# EAGLE design DualDCMotor (EAGLE 6.5.0)
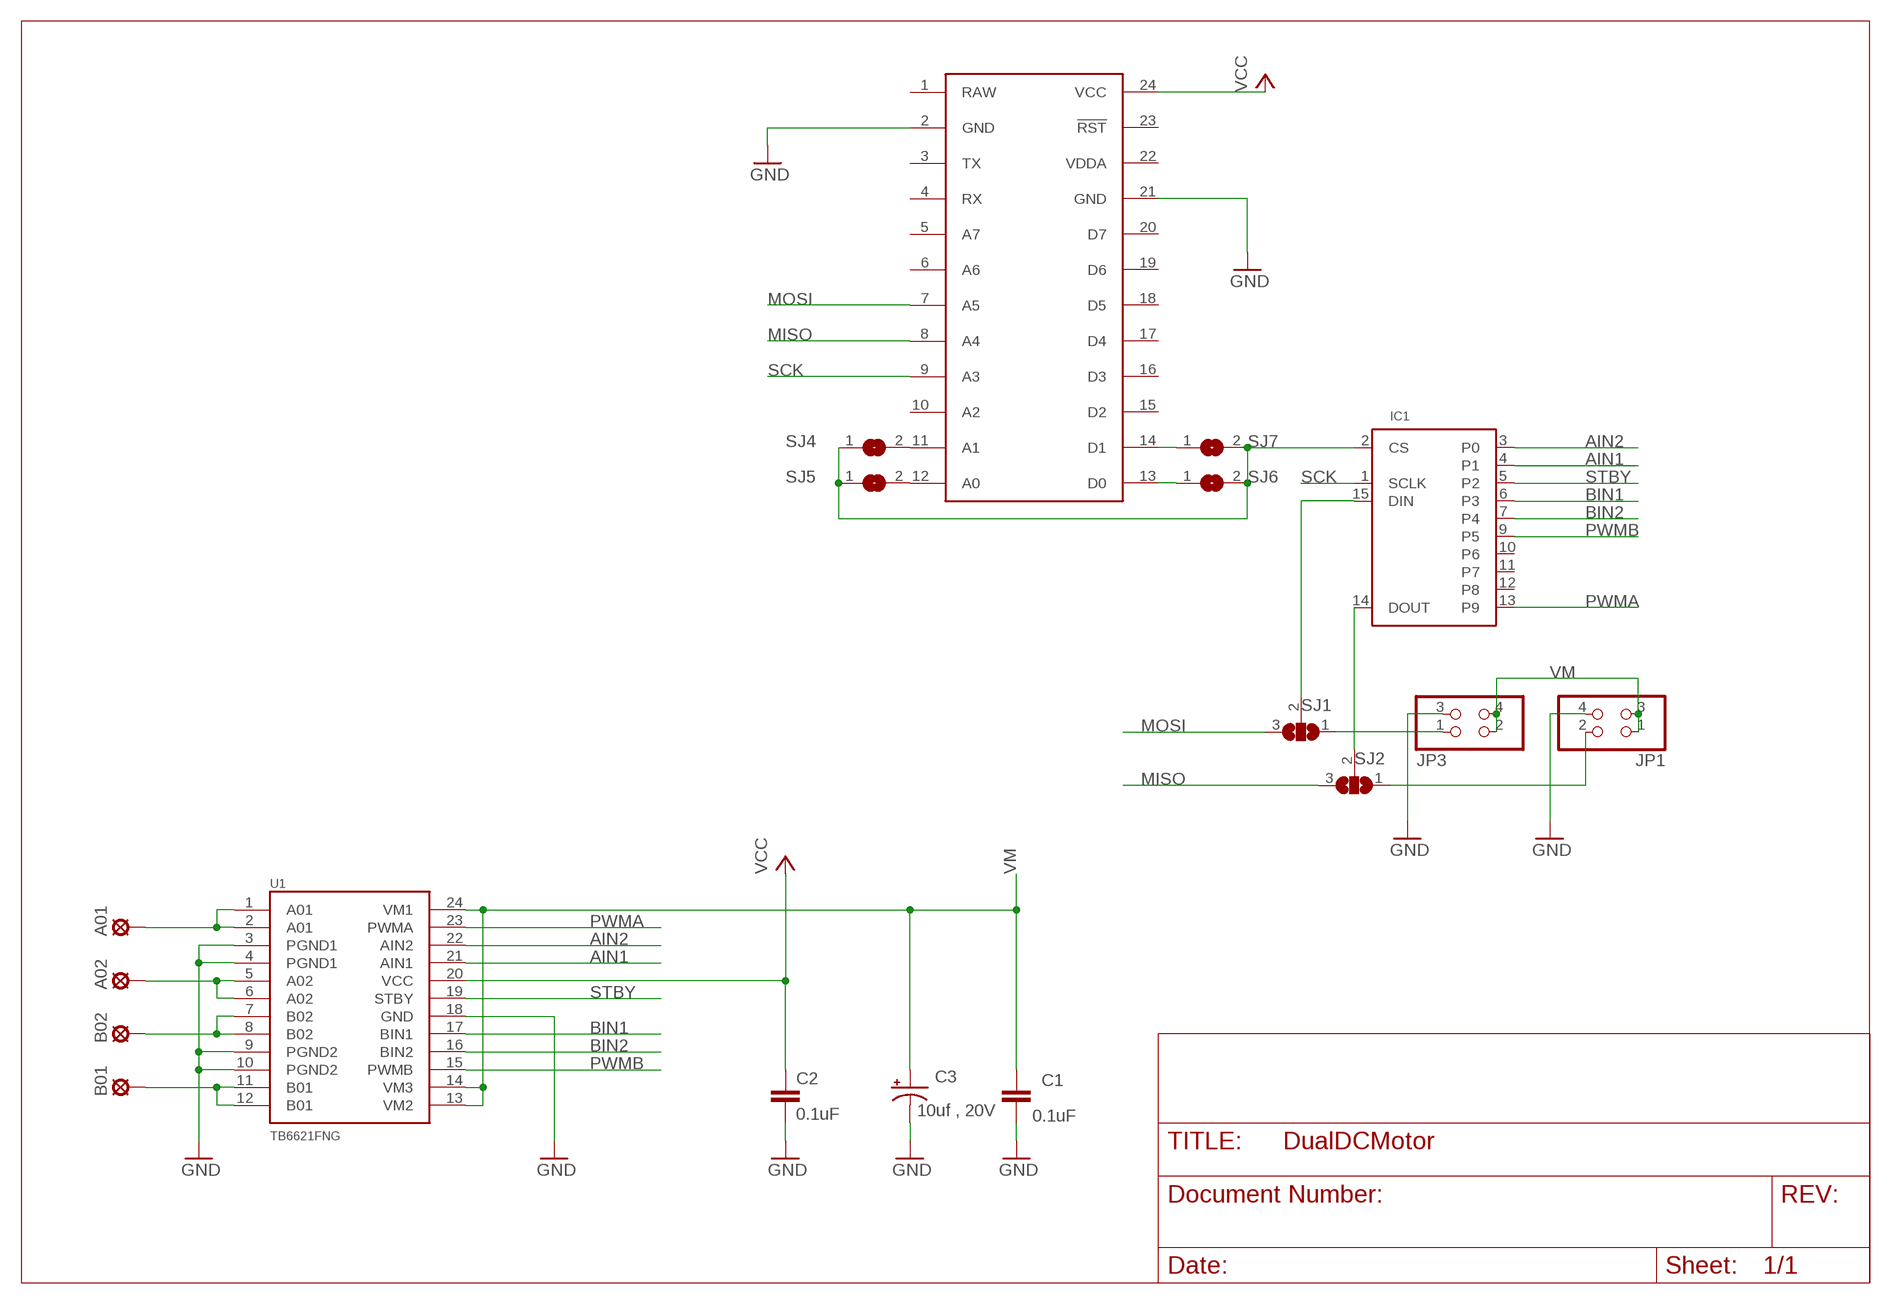
[diagram p0: schematic, sheet 1]

## Parts
A01  LSP13  [LSP13]
A02  LSP13  [LSP13]
B01  LSP13  [LSP13]
B02  LSP13  [LSP13]
C1  0.1uF  CAP0402-CAP  [0402-CAP]
C2  0.1uF  CAP0402-CAP  [0402-CAP]
C3  10uf , 20V  CAP_POL3528  [EIA3528]
IC1  MAX6966AEE  [QSOP16]
JP1  PINHD-2X02_2.54-SMD  [2X02SMD]
JP3  PINHD-2X02_2.54-SMD  [2X02SMD]
SJ1  SJ2W  [SJ_2]
SJ2  SJ2W  [SJ_2]
SJ4  SJ  [SJ]
SJ5  SJ  [SJ]
SJ6  SJ  [SJ]
SJ7  SJ  [SJ]
U1  TB6621FNG  [SSOP24]
U$1  SPARK_CORECORE  [SPARK_CORE]

## Nets
A01: A01.MP U1.1(A01) U1.2(A01)
A02: A02.MP U1.5(A02) U1.6(A02)
AIN1: IC1.4(P1) U1.21(AIN1)
AIN2: IC1.3(P0) U1.22(AIN2)
B01: B01.MP U1.11(B01) U1.12(B01)
B02: B02.MP U1.7(B02) U1.8(B02)
BIN1: IC1.6(P3) U1.17(BIN1)
BIN2: IC1.7(P4) U1.16(BIN2)
GND: C1.2 C2.2 C3.C(-) JP1.4 JP3.3 U1.3(PGND1) U1.4(PGND1) U1.9(PGND2) U1.10(PGND2) U1.18(GND) U$1.2(GND) U$1.21(GND)
MISO: SJ2.3 U$1.8(A4)
MOSI: SJ1.3 U$1.7(A5)
N$1: JP3.1 SJ1.1
N$2: JP1.2 SJ2.1
N$3: IC1.15(DIN) SJ1.2
N$4: IC1.14(DOUT) SJ2.2
N$6: SJ4.2 U$1.11(A1)
N$7: SJ5.2 U$1.12(A0)
N$8: SJ6.1 U$1.13(D0)
N$9: SJ7.1 U$1.14(D1)
N$15: IC1.2(CS) SJ4.1 SJ5.1 SJ6.2 SJ7.2
PWMA: IC1.13(P9) U1.23(PWMA)
PWMB: IC1.9(P5) U1.15(PWMB)
SCK: IC1.1(SCLK) U$1.9(A3)
STBY: IC1.5(P2) U1.19(STBY)
VCC: C2.1 U1.20(VCC) U$1.24(VCC)
VM: C1.1 C3.A(+) JP1.1 JP1.3 JP3.2 JP3.4 U1.13(VM2) U1.14(VM3) U1.24(VM1)
Unconnected: IC1.10(P6) IC1.11(P7) IC1.12(P8) U$1.3(TX) U$1.4(RX) U$1.5(A7) U$1.6(A6) U$1.10(A2) U$1.15(D2) U$1.16(D3) U$1.17(D4) U$1.18(D5) U$1.19(D6) U$1.20(D7) U$1.23(!RST)

## Power pins joined to a net without a drawn wire
GND: IC1.8(GND)
RAW: U$1.1(RAW)
VCC: IC1.16(VCC)
VDDA: U$1.22(VDDA)

## Library data of the parts
A01 A02 B01 B02 = solpad:LSP13: SOLDER PAD drill 1.3 mm, distributor Buerklin, 12H562
C1 C2 = SparkFun:CAP: Capacitor Standard 0603 ceramic capacitor, and 0.1" leaded capacitor.
C3 = SparkFun:CAP_POL: Capacitor Polarized These are standard SMD and PTH capacitors. Normally 10uF, 47uF, and 100uF in electrolytic and tantalum varieties. Always verify the external diameter of the through hole cap, it varies with capacity, voltage, and manufacturer. The EIA devices should be standard.
IC1 = max696x:MAX6966AEE
JP1 JP3 = pinhead-2:PINHD-2X02: PIN HEADER
SJ1 SJ2 = jumper:SJ2W: SMD solder JUMPER
SJ4-SJ7 = jumper:SJ: SMD solder JUMPER
U1 = SparkFun:TB6621FNG: Toshiba 1A motor driver
U$1 = Spark:SPARK_CORE

## Board
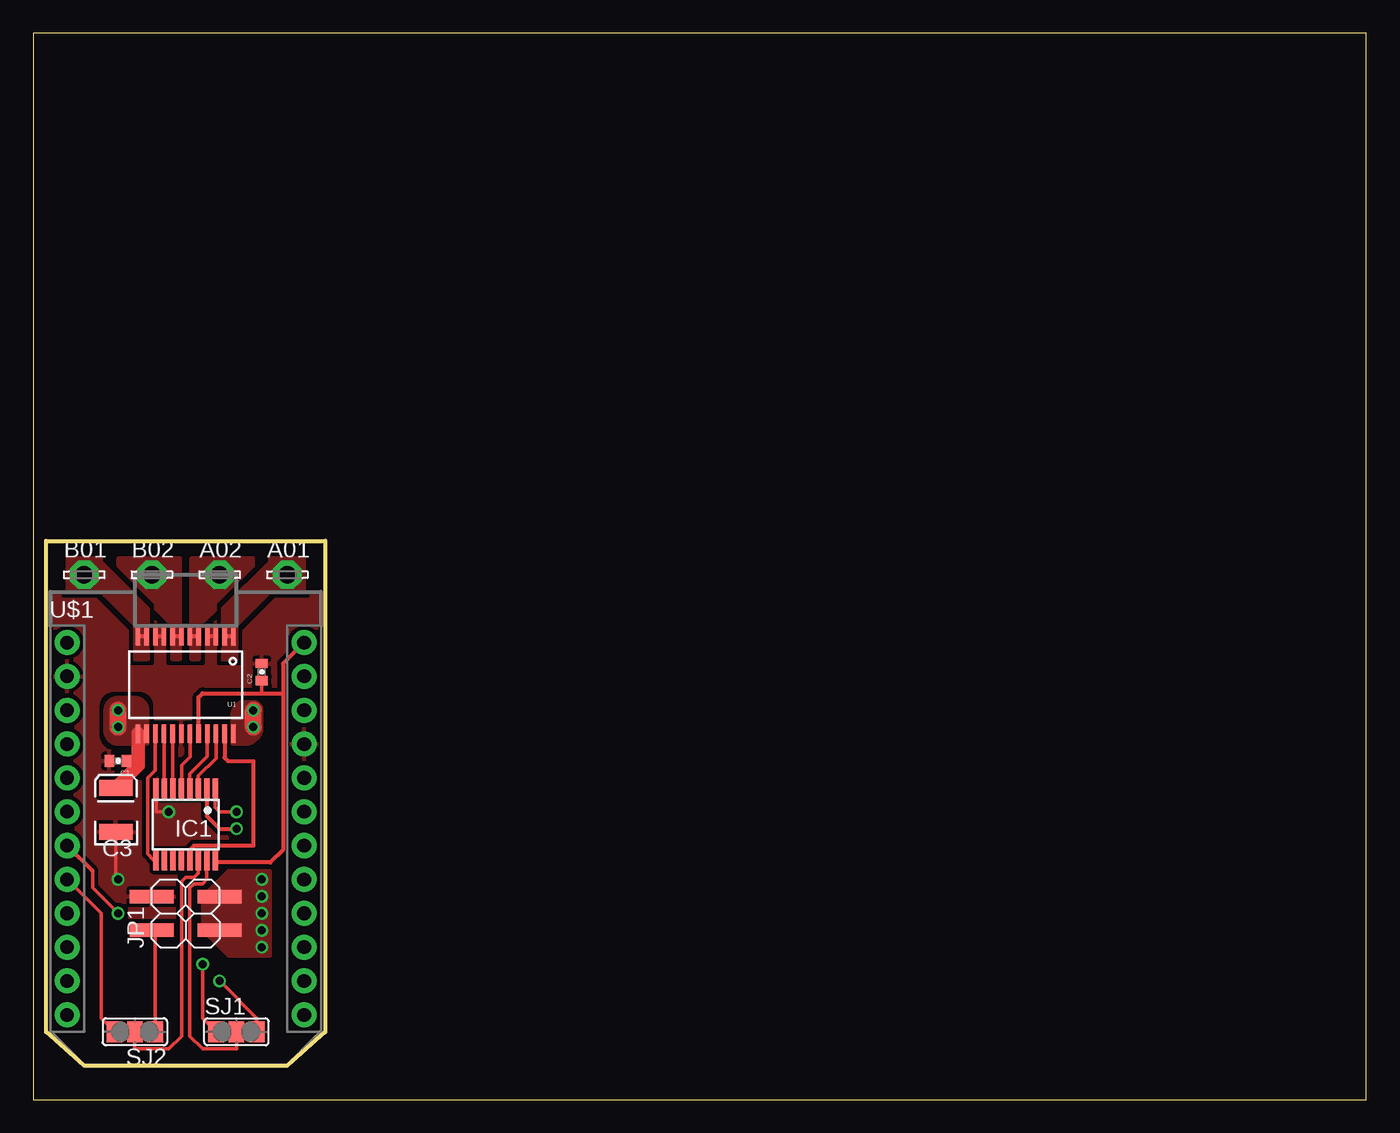
[diagram p1: board, top side]
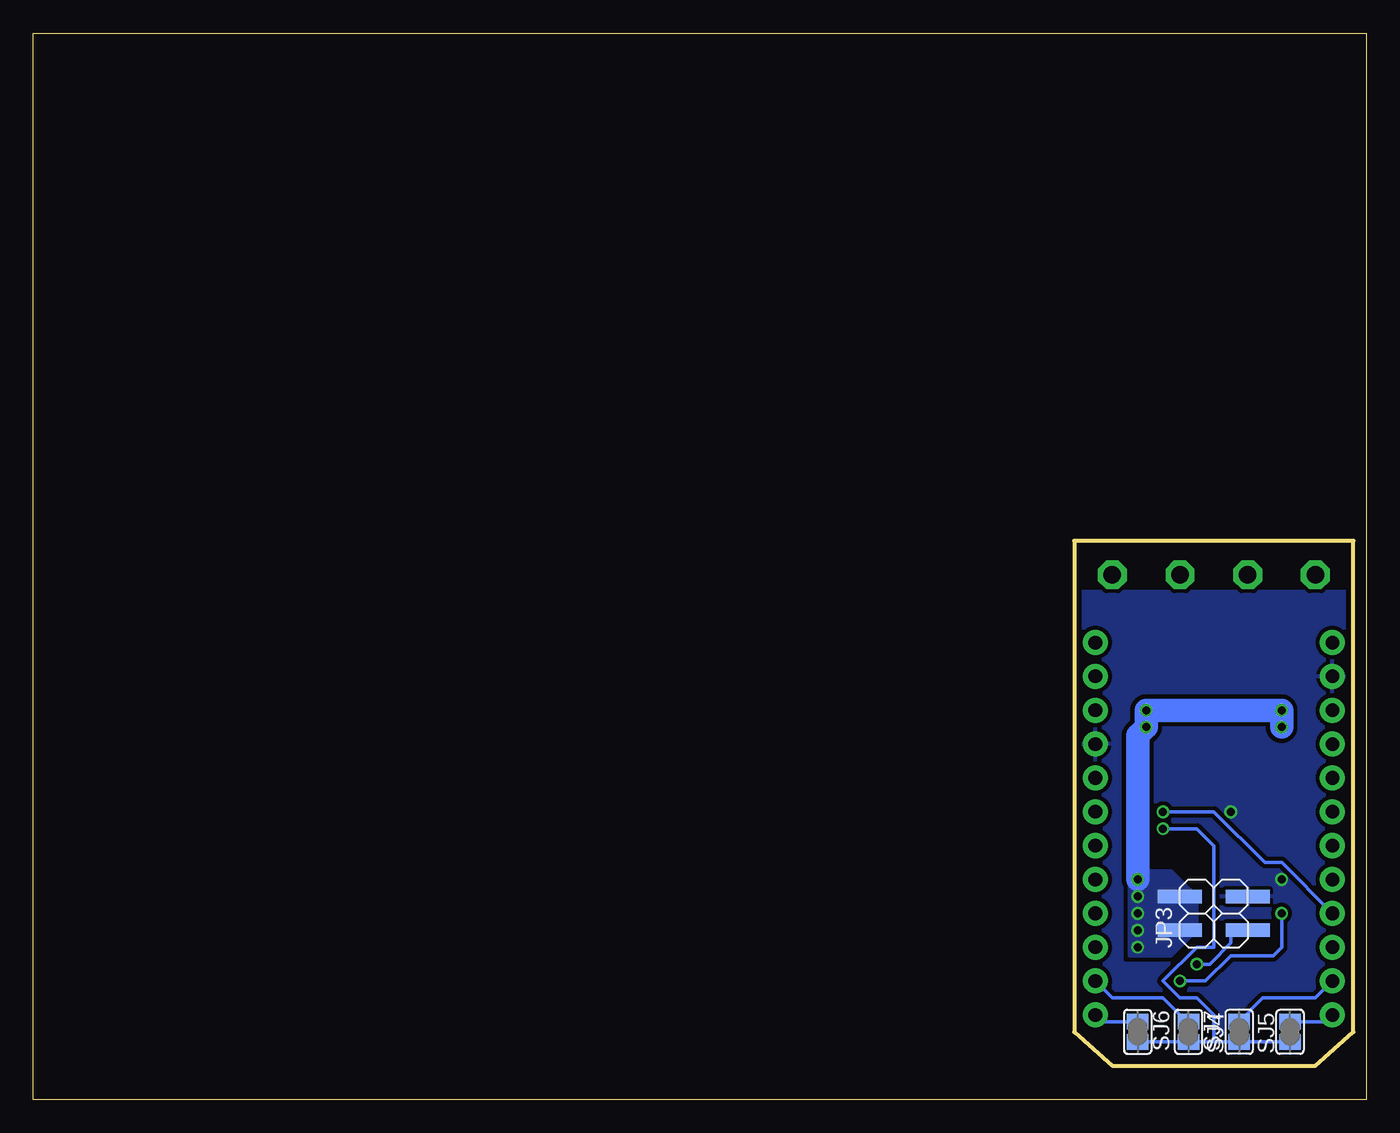
[diagram p2: board, bottom side, seen from below]

Size 100 x 80 mm. Coordinates in mm from the lower left corner, seen from the top.
Outline: 0,0 100,0 100,80 0,80 0,0
Outline: 0.95,41.91 21.91,41.91 21.91,5.08 19.05,2.54 3.81,2.54 0.95,5.08 0.95,41.91
Copper layers (1*16): Top 0.0356mm / dielectric 1.5011mm / Bottom 0.0356mm
Design rules "LaenPCBOrder": minimum track width 6mil, minimum drill 13mil, track to track 6mil, track to pad 6mil, pad to pad 6mil, via to via 6mil, smd to smd 6mil, copper to edge 15mil, drill to drill 6mil, minimum pad ring 7mil, minimum via ring 7mil, stop-mask expansion 3mil, vias tented up to drill 0mil, thermal gap 10mil

### Footprints (pad centres in the part's own frame; a part is rotated, then mirrored left to right if it is on the bottom)
LSP13 = drill 1.321 pad 2.159 octagon: MP 0,0
0402-CAP = smd 0.7 x 0.9: 1 -0.65,0; 2 0.65,0
EIA3528 = smd 1.2 x 2.5: A 1.65,0; C -1.65,0
QSOP16 = smd 0.406 x 1.5: 1 -2.223,-2.69; 2 -1.587,-2.69; 3 -0.953,-2.69; 4 -0.318,-2.69; 5 0.318,-2.69; 6 0.953,-2.69; 7 1.587,-2.69; 8 2.223,-2.69; 9 2.223,2.69; 10 1.587,2.69; 11 0.953,2.69; 12 0.318,2.69; 13 -0.318,2.69; 14 -0.953,2.69; 15 -1.587,2.69; 16 -2.223,2.69
2X02SMD = smd 1.016 x 3.302: 1 -1.27,-3.81; 2 -1.27,1.27; 3 1.27,-3.81; 4 1.27,1.27
SJ_2 = smd 1.168 x 1.6: 1 -1.524,0; 2 0,0; 3 1.524,0
SJ = smd 1.168 x 1.6: 1 -0.762,0; 2 0.762,0
SSOP24 = smd 0.348 x 1.397: 1 -3.575,-3.656; 2 -2.925,-3.656; 3 -2.275,-3.656; 4 -1.625,-3.656; 5 -0.975,-3.656; 6 -0.325,-3.656; 7 0.325,-3.656; 8 0.975,-3.656; 9 1.625,-3.656; 10 2.275,-3.656; 11 2.925,-3.656; 12 3.575,-3.656; 13 3.575,3.656; 14 2.925,3.656; 15 2.275,3.656; 16 1.625,3.656; 17 0.975,3.656; 18 0.325,3.656; 19 -0.325,3.656; 20 -0.975,3.656; 21 -1.625,3.656; 22 -2.275,3.656; 23 -2.925,3.656; 24 -3.575,3.656
SPARK_CORE = drill 1.016 pad 1.88: 1 -8.89,13.97; 2 -8.89,11.43; 3 -8.89,8.89; 4 -8.89,6.35; 5 -8.89,3.81; 6 -8.89,1.27; 7 -8.89,-1.27; 8 -8.89,-3.81; 9 -8.89,-6.35; 10 -8.89,-8.89; 11 -8.89,-11.43; 12 -8.89,-13.97; 13 8.89,-13.97; 14 8.89,-11.43; 15 8.89,-8.89; 16 8.89,-6.35; 17 8.89,-3.81; 18 8.89,-1.27; 19 8.89,1.27; 20 8.89,3.81; 21 8.89,6.35; 22 8.89,8.89; 23 8.89,11.43; 24 8.89,13.97

### Placement (x,y rotation side)
A01  19.05,39.37 0 top
A02  13.97,39.37 0 top
B01  3.81,39.37 0 top
B02  8.89,39.37 0 top
C1  6.35,25.4 180 top
C2  17.14,32.07 90 top
C3  6.19,21.75 90 top
IC1  11.43,20.64 180 top
JP1  10.16,13.97 90 top
JP3  12.7,13.97 90 bottom
SJ1  15.24,5.08 0 top
SJ2  7.62,5.08 180 top
SJ4  9.53,5.08 90 bottom
SJ5  5.71,5.08 90 bottom
SJ6  17.14,5.08 270 bottom
SJ7  13.34,5.08 270 bottom
U1  11.43,31.11 180 top
U$1  11.43,20.32 0 top

### Tracks (layer width: path | path; a pad name or v marks a point on that pad's centre or on a via)
A01
  Top 0.305: U1.2 U1.1
  pour Top (isolate 0.305, no thermals): 17.78,40.64 17.78,40.39 14.22,36.83 14.22,33.02 15.24,33.02 15.24,35.56 17.78,38.1 20.32,38.1 20.32,40.64
A02
  Top 0.305: U1.6 U1.5
  pour Top (isolate 0.305, rank 2, no thermals): 11.84,40.64 11.84,33.02 12.45,33.02 12.45,35.56 16.51,39.37 16.51,40.64
AIN1
  Top 0.254: U1.21 13.05,25.75 11.75,24.45 IC1.4
AIN2
  Top 0.254: U1.22 13.71,25.59 12.38,24.27 IC1.3
B01
  Top 0.305: U1.12 U1.11
  pour Top (isolate 0.305, no thermals): 5.08,40.64 5.08,40.39 8.64,36.83 8.64,33.02 7.87,33.02 7.62,33.02 7.62,35.56 5.08,38.1 2.54,38.1 2.54,40.64
B02
  Top 0.305: U1.8 U1.7
  pour Top (isolate 0.305, rank 2, no thermals): 11.02,40.64 11.02,33.02 10.41,33.02 10.41,35.56 6.35,39.62 6.35,40.64
BIN1
  Top 0.254: U1.17 10.46,23.03
  Top 0.305: 10.46,23.03 IC1.6
BIN2
  Top 0.254: U1.16 9.8,23.05
  Top 0.305: 9.8,23.05 IC1.7
GND  (via drill 0.6)
  Top 0.254: IC1.8 9.21,21.59 v10.16,21.59 | C3.C 6.19,16.67 v6.35,16.51
  Top 0.305: U1.10 U1.9 | U1.4 U1.3
  pour Bottom (isolate 0.305, rank 2): 1.27,38.1 21.59,38.1 21.59,2.54 1.27,2.54
  pour Top (isolate 0.305, rank 3): 1.27,38.1 21.59,38.1 21.59,2.54 1.27,2.54
  pour Top (rank 5, no thermals): 9.84,33.66 9.84,35.4 9.21,35.4 9.21,33.66
  pour Top (no thermals): 13.02,33.66 13.02,35.4 13.65,35.4 13.65,33.66
MISO
  Top 0.254: U$1.8 5.08,13.97 5.08,6.1 SJ2.3
MOSI  (via drill 0.6)
  Top 0.254: SJ1.3 16.76,6.1 v13.97,8.89 | 4.45,17.14 4.45,15.88 v6.35,13.97
  Top 0.305: U$1.7 4.45,17.14
  Bottom 0.254: v6.35,13.97 6.35,11.43 6.99,10.79 10.16,10.79 12.06,8.89 v13.97,8.89
N$1  (via drill 0.6)
  Top 0.254: SJ1.1 12.7,6.1 v12.7,10.16
  Bottom 0.254: JP3.1 10.16,12.7 10.16,11.75 11.75,10.16 v12.7,10.16
N$2
  Top 0.254: SJ2.1 9.14,12.45
  Top 0.305: 9.14,12.45 JP1.2
N$3
  Top 0.254: SJ1.2 15.24,3.81 12.7,3.81 11.75,4.76 11.75,15.88 12.06,16.19 12.7,16.19 13.02,16.51 IC1.15
N$4
  Top 0.254: SJ2.2 7.62,3.81 10.16,3.81 11.11,4.76 11.11,16.35 11.43,16.67 12.06,16.67 12.38,16.99 IC1.14
N$6
  Bottom 0.254: U$1.11 3.81,7.62 7.75,7.62 SJ4.2
N$7
  Bottom 0.254: U$1.12 3.05,5.84 SJ5.2
N$8
  Bottom 0.254: U$1.13 19.81,5.84 SJ6.1
N$9
  Bottom 0.254: U$1.14 19.05,7.62 15.24,7.62 13.46,5.84 SJ7.1
N$15  (via drill 0.6)
  Top 0.305: IC1.2 13.02,21.27 13.97,20.32 v15.24,20.32
  Bottom 0.254: SJ5.1 SJ4.1 11.43,4.32 | 11.43,4.32 SJ7.2 SJ6.2 | 11.43,4.32 11.43,6.35 12.7,7.62 13.97,7.62 15.24,8.89 12.7,11.43 11.43,11.43 11.43,19.05 12.7,20.32 v15.24,20.32
PWMA
  Top 0.305: U1.23 14.36,25.65 14.61,25.4 16.51,25.4 16.51,19.05 12.06,19.05 11.75,18.73 IC1.13
PWMB
  Top 0.254: U1.15 9.15,24.71 8.57,24.13 8.57,18.41 9.04,17.95 IC1.9
SCK  (via drill 0.6)
  Top 0.254: IC1.1 13.65,21.91 13.97,21.59 v15.24,21.59
  Bottom 0.254: v15.24,21.59 11.43,21.59 7.62,17.78 6.35,17.78 U$1.9
STBY
  Top 0.254: 11.76,25.73 11.11,25.08 IC1.5
  Top 0.279: U1.19 11.76,25.73
VCC
  Top 0.254: C2.1 17.14,30.48
  Top 0.305: U$1.24 18.73,32.7 18.73,30.48 | 18.73,30.48 18.73,18.73 17.78,17.78 13.8,17.78 IC1.16 | U1.20 12.4,30.18 12.7,30.48 17.14,30.48 18.73,30.48
VM  (via drill 0.6)
  Top 0.254: C1.1 7.86,25.4
  Top 0.305: U1.13 U1.14
  Top 1.016: C3.A 7.86,25.06 7.86,25.4 U1.13
  Top 1.27: v6.35,27.94 v6.35,29.21 | v16.51,27.94 v16.51,29.21
  Bottom 1.778: v17.14,16.51 17.14,27.3 v16.51,27.94 v16.51,29.21 v6.35,29.21 v6.35,27.94
  other vias: 17.14,15.24 17.14,13.97 17.14,12.7 17.14,11.43
  pour Bottom (no thermals): 12.7,15.24 12.7,12.7 14.61,10.79 17.78,10.79 17.78,17.14 14.61,17.14
  pour Top (no thermals): 12.7,15.24 14.61,17.14 17.78,17.14 17.78,10.79 14.61,10.79 12.7,12.7
  pour Top (no thermals): 5.4,29.21 5.4,27.94 5.4,27.62 arc90 6.35,26.67 8.57,26.67 8.57,29.21 arc90 7.62,30.16 6.35,30.16 arc90
  pour Top (no thermals): 17.14,27.94 arc-90 15.88,26.67 14.92,26.67 14.92,28.89 arc-90 15.88,29.84 16.51,29.84 arc-90 17.14,29.21